# EAGLE schematic Ninja-towns (EAGLE 7.2.0)
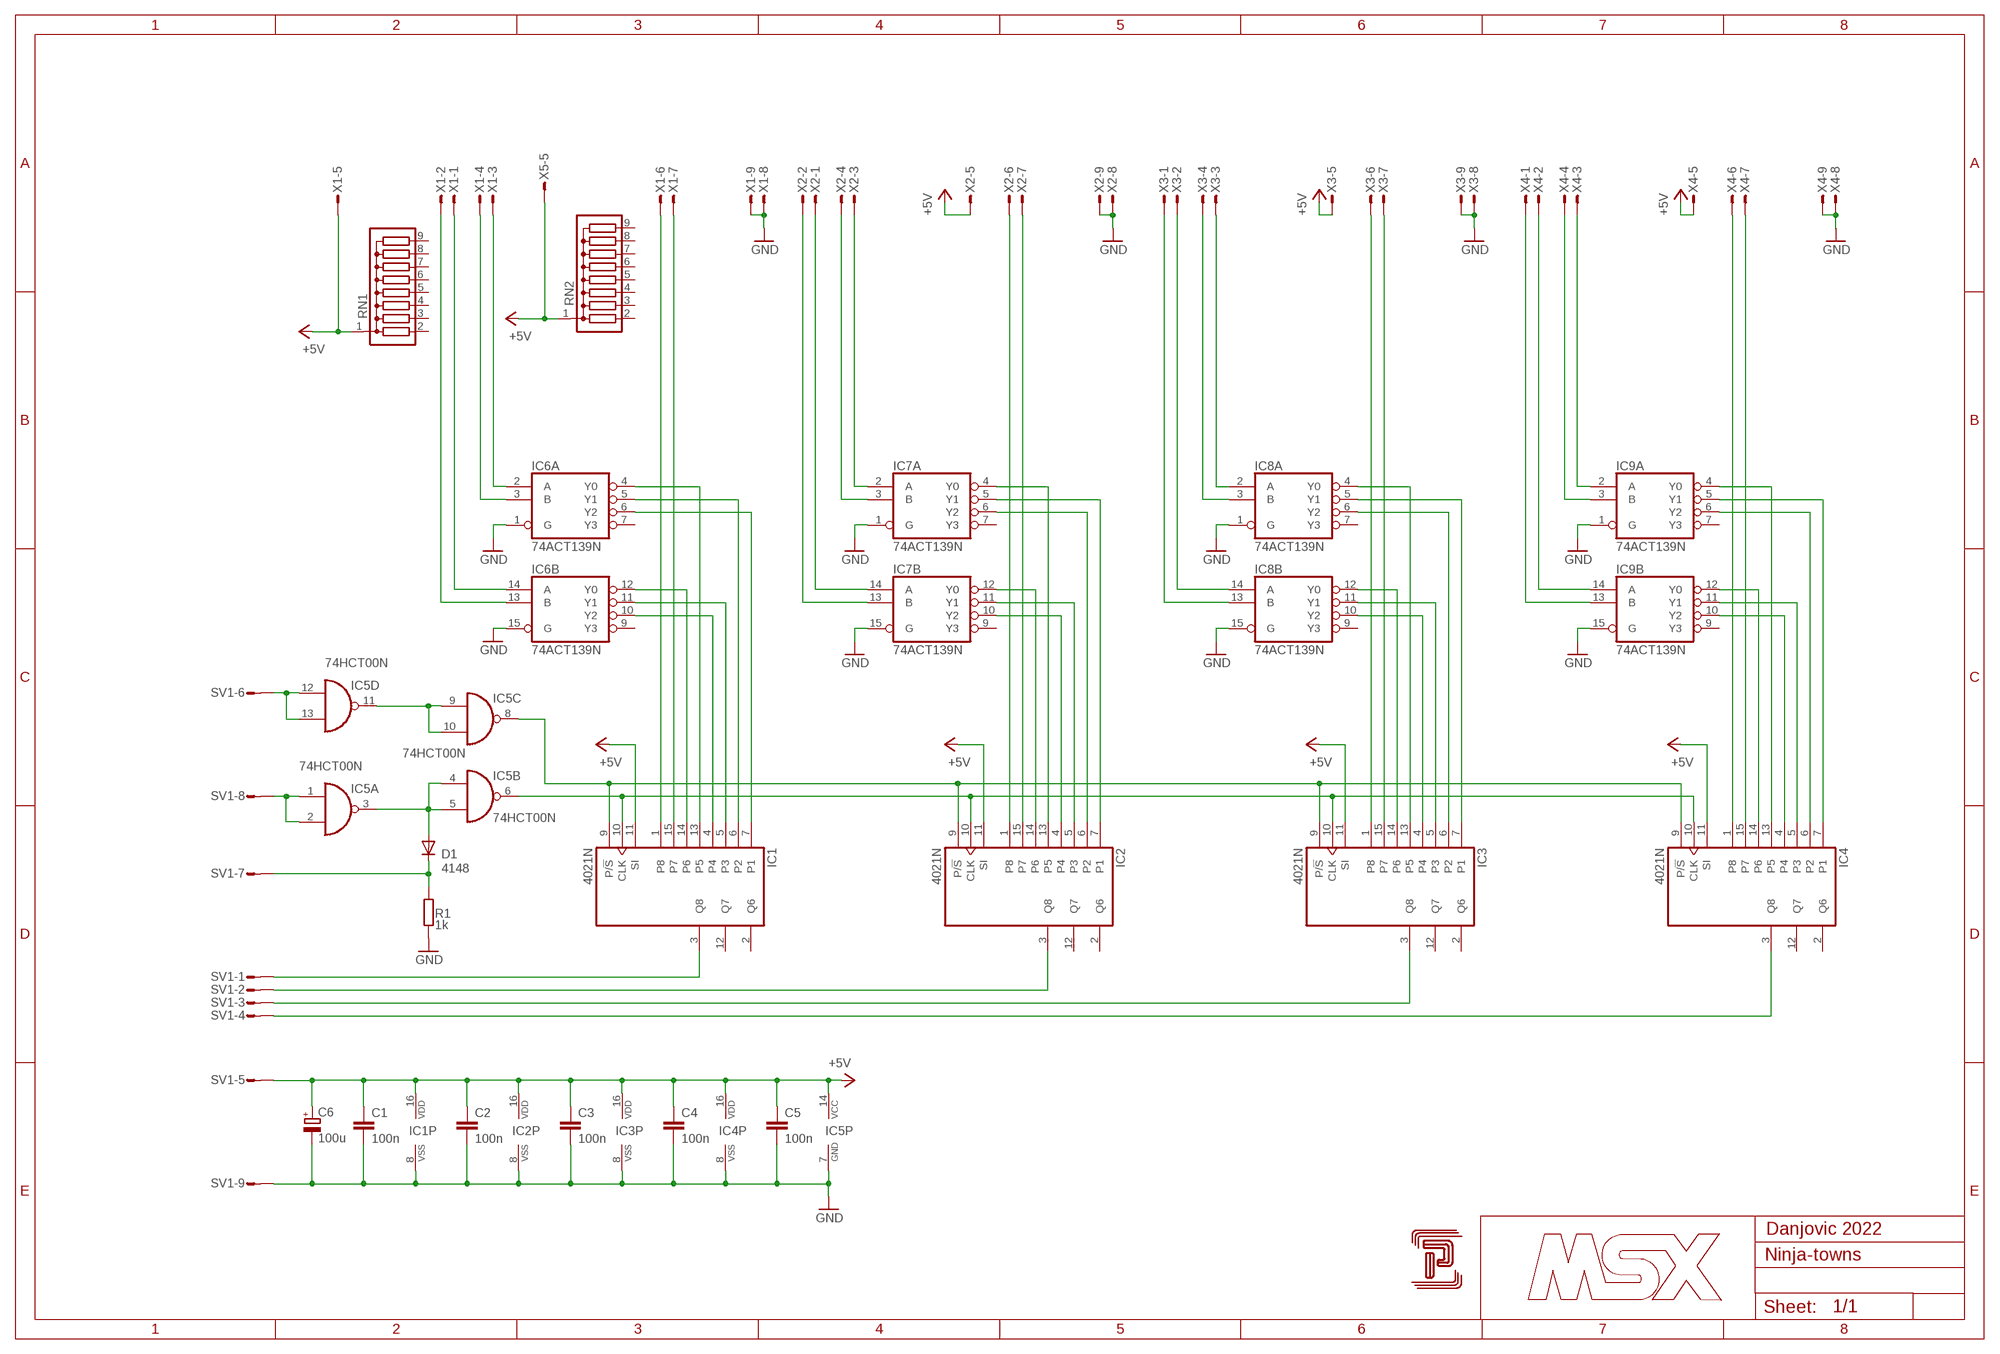
[diagram p0: schematic, sheet 1]

## Parts
C1  100n  C-EU050-024X044  [C050-024X044]
C2  100n  C-EU050-024X044  [C050-024X044]
C3  100n  C-EU050-024X044  [C050-024X044]
C4  100n  C-EU050-024X044  [C050-024X044]
C5  100n  C-EU050-024X044  [C050-024X044]
C6  100u  CPOL-EUE2.5-6  [E2,5-6]
D1  4148  DIODE-D-5  [D-5]
IC1  4021N  [DIL16]
IC2  4021N  [DIL16]
IC3  4021N  [DIL16]
IC4  4021N  [DIL16]
IC5  74HCT00N  [DIL14]
IC6  74ACT139N  [DIL16]
IC7  74ACT139N  [DIL16]
IC8  74ACT139N  [DIL16]
IC9  74ACT139N  [DIL16]
R1  1k  R-EU_0204/7L  [0204/7L]
RN1  G08R  [SIL9]
RN2  G08R  [SIL9]
SV1  S09P  [S09P]
U$1  PB-202_TOP  [PB202-TOP]
X1  M09-182S  [182-009-MALE]
X2  M09-182S  [182-009-MALE]
X3  M09-182S  [182-009-MALE]
X4  M09-182S  [182-009-MALE]
X5  M09-182S  [182-009-MALE]

## Nets
+5V: C1.1 C2.1 C3.1 C4.1 C5.1 C6.+ IC1.11(SI) IC1.16(VDD) IC2.11(SI) IC2.16(VDD) IC3.11(SI) IC3.16(VDD) IC4.11(SI) IC4.16(VDD) IC5.14(P:VCC) RN1.1 RN2.1 SV1.5 X1.5 X2.5 X3.5 X4.5 X5.5
GND: C1.2 C2.2 C3.2 C4.2 C5.2 C6.- IC1.8(VSS) IC2.8(VSS) IC3.8(VSS) IC4.8(VSS) IC5.7(P:GND) IC6.1(A:G) IC6.15(B:G) IC7.1(A:G) IC7.15(B:G) IC8.1(A:G) IC8.15(B:G) IC9.1(A:G) IC9.15(B:G) R1.1 SV1.9 X1.8 X1.9 X2.8 X2.9 X3.8 X3.9 X4.8 X4.9
N$1: IC1.3(Q8) SV1.1
N$2: IC2.3(Q8) SV1.2
N$3: IC3.3(Q8) SV1.3
N$4: IC4.3(Q8) SV1.4
N$5: D1.A IC5.3(A:O) IC5.4(B:I0) IC5.5(B:I1)
N$6: IC1.10(CLK) IC2.10(CLK) IC3.10(CLK) IC4.10(CLK) IC5.6(B:O)
N$7: IC1.1(P8) X1.6
N$8: IC1.15(P7) X1.7
N$9: IC1.14(P6) IC6.12(B:Y0)
N$10: IC1.13(P5) IC6.4(A:Y0)
N$11: IC1.4 IC6.10(B:Y2)
N$12: IC1.5(P3) IC6.11(B:Y1)
N$13: IC1.6(P2) IC6.5(A:Y1)
N$14: IC1.7(P1) IC6.6(A:Y2)
N$15: IC2.1(P8) X2.6
N$16: IC2.15(P7) X2.7
N$17: IC2.14(P6) IC7.12(B:Y0)
N$18: IC2.13(P5) IC7.4(A:Y0)
N$19: IC2.4 IC7.10(B:Y2)
N$20: IC2.5(P3) IC7.11(B:Y1)
N$21: IC2.6(P2) IC7.6(A:Y2)
N$22: IC2.7(P1) IC7.5(A:Y1)
N$23: IC3.1(P8) X3.6
N$24: IC3.15(P7) X3.7
N$25: IC3.14(P6) IC8.12(B:Y0)
N$26: IC3.13(P5) IC8.4(A:Y0)
N$27: IC3.4 IC8.10(B:Y2)
N$28: IC3.5(P3) IC8.11(B:Y1)
N$29: IC3.6(P2) IC8.6(A:Y2)
N$30: IC3.7(P1) IC8.5(A:Y1)
N$31: IC4.1(P8) X4.6
N$32: IC4.15(P7) X4.7
N$33: IC4.14(P6) IC9.12(B:Y0)
N$34: IC4.13(P5) IC9.4(A:Y0)
N$35: IC4.4 IC9.10(B:Y2)
N$36: IC4.5(P3) IC9.11(B:Y1)
N$37: IC4.6(P2) IC9.6(A:Y2)
N$38: IC4.7(P1) IC9.5(A:Y1)
N$39: IC5.9(C:I0) IC5.10(C:I1) IC5.11(D:O)
N$40: IC6.2(A:A) X1.3
N$41: IC1.9(P/!S) IC2.9(P/!S) IC3.9(P/!S) IC4.9(P/!S) IC5.8(C:O)
N$42: IC5.12(D:I0) IC5.13(D:I1) SV1.6
N$43: IC5.1(A:I0) IC5.2(A:I1) SV1.8
N$44: D1.C R1.2 SV1.7
N$45: IC6.3(A:B) X1.4
N$46: IC6.14(B:A) X1.1
N$47: IC6.13(B:B) X1.2
N$48: IC7.2(A:A) X2.3
N$49: IC7.3(A:B) X2.4
N$50: IC7.14(B:A) X2.1
N$51: IC7.13(B:B) X2.2
N$52: IC8.2(A:A) X3.3
N$53: IC8.3(A:B) X3.4
N$54: IC9.2(A:A) X4.3
N$55: IC8.14(B:A) X3.2
N$56: IC8.13(B:B) X3.1
N$57: IC9.3(A:B) X4.4
N$58: IC9.14(B:A) X4.2
N$59: IC9.13(B:B) X4.1
Unconnected: IC1.2(Q6) IC1.12(Q7) IC2.2(Q6) IC2.12(Q7) IC3.2(Q6) IC3.12(Q7) IC4.2(Q6) IC4.12(Q7) IC6.7(A:Y3) IC6.9(B:Y3) IC7.7(A:Y3) IC7.9(B:Y3) IC8.7(A:Y3) IC8.9(B:Y3) IC9.7(A:Y3) IC9.9(B:Y3) RN1.2 RN1.3 RN1.4 RN1.5 RN1.6 RN1.7 RN1.8 RN1.9 RN2.2 RN2.3 RN2.4 RN2.5 RN2.6 RN2.7 RN2.8 RN2.9 X5.1 X5.2 X5.3 X5.4 X5.6 X5.7 X5.8 X5.9

## Notes on the sheet
- Danjovic 2022

## Power pins joined to a net without a drawn wire
GND: IC6.8(P:GND) IC7.8(P:GND) IC8.8(P:GND) IC9.8(P:GND)
VCC: IC6.16(P:VCC) IC7.16(P:VCC) IC8.16(P:VCC) IC9.16(P:VCC)

## Library data of the parts
C1-C5 = rcl:C-EU: CAPACITOR, European symbol
C6 = rcl:CPOL-EU: POLARIZED CAPACITOR, European symbol
D1 = diode:DIODE-: DIODE
IC1-IC4 = 40xx:4021: 8-bit static SHIFT REGISTER
IC5 = 74xx-eu:74*00: Quad 2-input NAND gate
IC6-IC9 = 74xx-eu:74*139: Dual 2-line to 4-line DECODER/DEMULTIPLEXER
R1 = rcl:R-EU_: RESISTOR, European symbol
RN1 RN2 = resistor-sil:G08R: SIL RESISTOR; OC_FARNELL: unknown; OC_NEWARK: unknown
SV1 = con-amp-mt:S09P: AMP MT CONNECTOR; OC_FARNELL: unknown; OC_NEWARK: unknown
U$1 = box-patola:PB-: PATOLA PB series plastic boxes www.patola.com.br
X1-X5 = con-subd:M09?S: SUB-D; OC_FARNELL: unknown; OC_NEWARK: unknown